# EAGLE design led_svitilna (EAGLE 6.5.0)
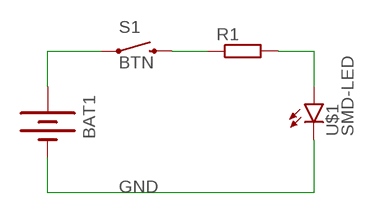
[diagram p0: schematic, sheet 1]

## Parts
BAT1  BATTERY20SMD  [BATTCON_20MM]
R1  R-EU_R1206  [R1206]
S1  BTN  SWITCH-MOMENTARY-2SMD-4  [TACTILE_SWITCH_TALL]
U$1  SMD-LED  [SMD-LED]

## Nets
GND: BAT1.2(-) U$1.K(C)
N$1: BAT1.1(+) S1.A2
N$2: R1.1 S1.B2
N$3: R1.2 U$1.A

## Library data of the parts
BAT1 = SparkFun-Electromechanical:BATTERY: Battery Holders Various common sizes : AA, AAA, 18650 (PRT-12895), 20mm coin cell and 12mm coin cell. 20MM_4LEGS, BATT-10373
R1 = rcl:R-EU_: RESISTOR, European symbol
S1 = SparkFun-Electromechanical:SWITCH-MOMENTARY-2: Various NO switches- pushbuttons, reed, etc; PROD_ID: SWCH-11966
U$1 = led:SMD-LED

## Board
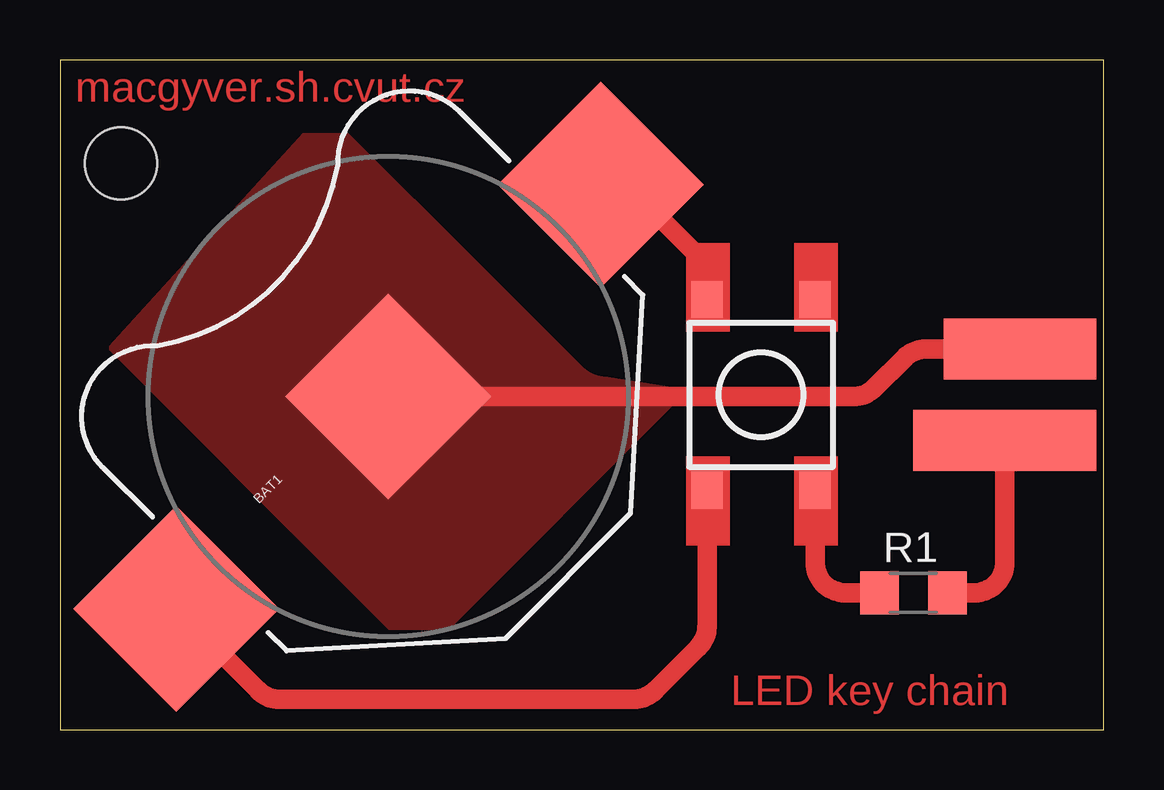
[diagram p1: board, top side]
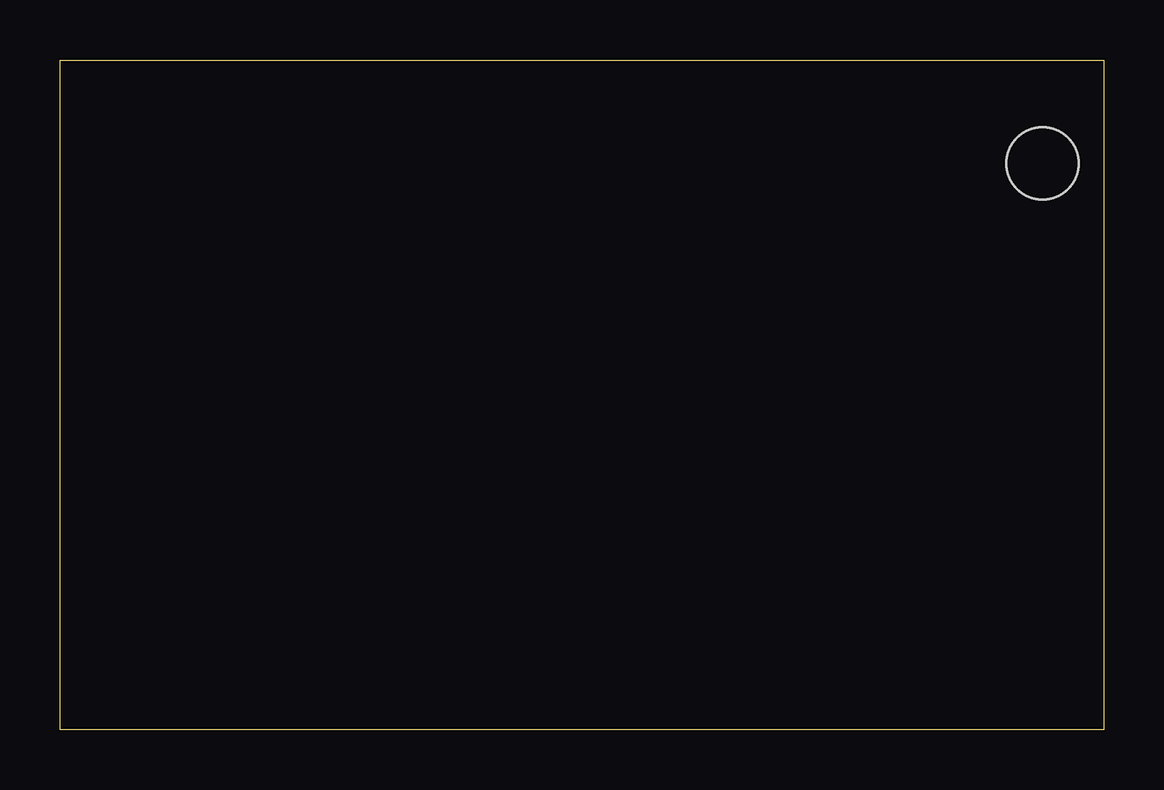
[diagram p2: board, bottom side, seen from below]

Size 43.48 x 27.93 mm. Coordinates in mm from the lower left corner, seen from the top.
Outline: 0,0 43.48,0 43.48,27.93 0,27.93 0,0
Copper layers (1*16): Top 0.035mm / dielectric 1.5mm / Bottom 0.035mm
Design rules "default": minimum track width 10mil, minimum drill 24mil, track to track 8mil, track to pad 8mil, pad to pad 8mil, via to via 8mil, smd to smd 8mil, copper to edge 40mil, drill to drill 8mil, minimum pad ring 10mil, minimum via ring 8mil, stop-mask expansion 4mil, vias tented up to drill 0mil, thermal gap 10mil
Holes 3 mm at 2.54,23.62
tRestrict: area -5.6,0.3 to 30.2,30.2; area 0.5,16.5 to 10.5,27.5

### Footprints (pad centres in the part's own frame; a part is rotated, then mirrored left to right if it is on the bottom)
BATTCON_20MM = smd 6.07 x 6.07: 1 -12.5,0; 2 0,0; 3 12.5,0
R1206 = smd 1.6 x 1.803: 1 -1.422,0; 2 1.422,0
TACTILE_SWITCH_TALL = smd 1.55 x 1.3: A1 -3.975,-2.25; A2 3.975,-2.25; B1 -3.975,2.25; B2 3.975,2.25
SMD-LED = smd 7.62 x 2.54: A -3.81,-1.905 | smd 6.35 x 2.54: K -3.175,1.905

### Placement (x,y rotation side)
BAT1  13.68,13.89 45 top
R1  35.56,5.71 0 top
S1  29.21,13.97 270 top
U$1  43.18,13.97 0 top

### Tracks (layer width: path | path; a pad name or v marks a point on that pad's centre or on a via)
GND
  Top 0.813: BAT1.2 33.05,13.89 arc45 33.95,14.26 35.19,15.5 arc-45 36.09,15.87 U$1.K
  pour Top (isolate 1.27, no thermals): -1.27,27.94 29.21,27.94 29.21,0 -1.27,0
  pour Bottom: 50.1,36.2 54.9,36.2 54.9,18.9 48.8,17 48.4,18.4 50.1,18.4
N$1
  Top 0.813: S1.A2 26.96,4.34 arc-45 26.59,3.44 24.79,1.64 arc-45 23.89,1.27 9.16,1.27 arc-45 8.26,1.64 BAT1.1
N$2
  Top 0.813: S1.B2 31.46,6.98 arc90 32.73,5.71 R1.1
N$3
  Top 0.813: R1.2 38.1,5.71 arc90 39.37,6.98 U$1.A
N$4  (via drill 0.6)
  other vias: 2.54,23.62
N$5
  Top 0.813: 22.86,23.5 27.3,19.05
(copper drawn outside any net)
  shapes: Top area x4

### Text on the board
Top: macgyver.sh.cvut.cz | LED key chain